# Altium schematic sheet Microcontrolador.SchDoc
size A4; SheetNumber: 3; SheetTotal: 3
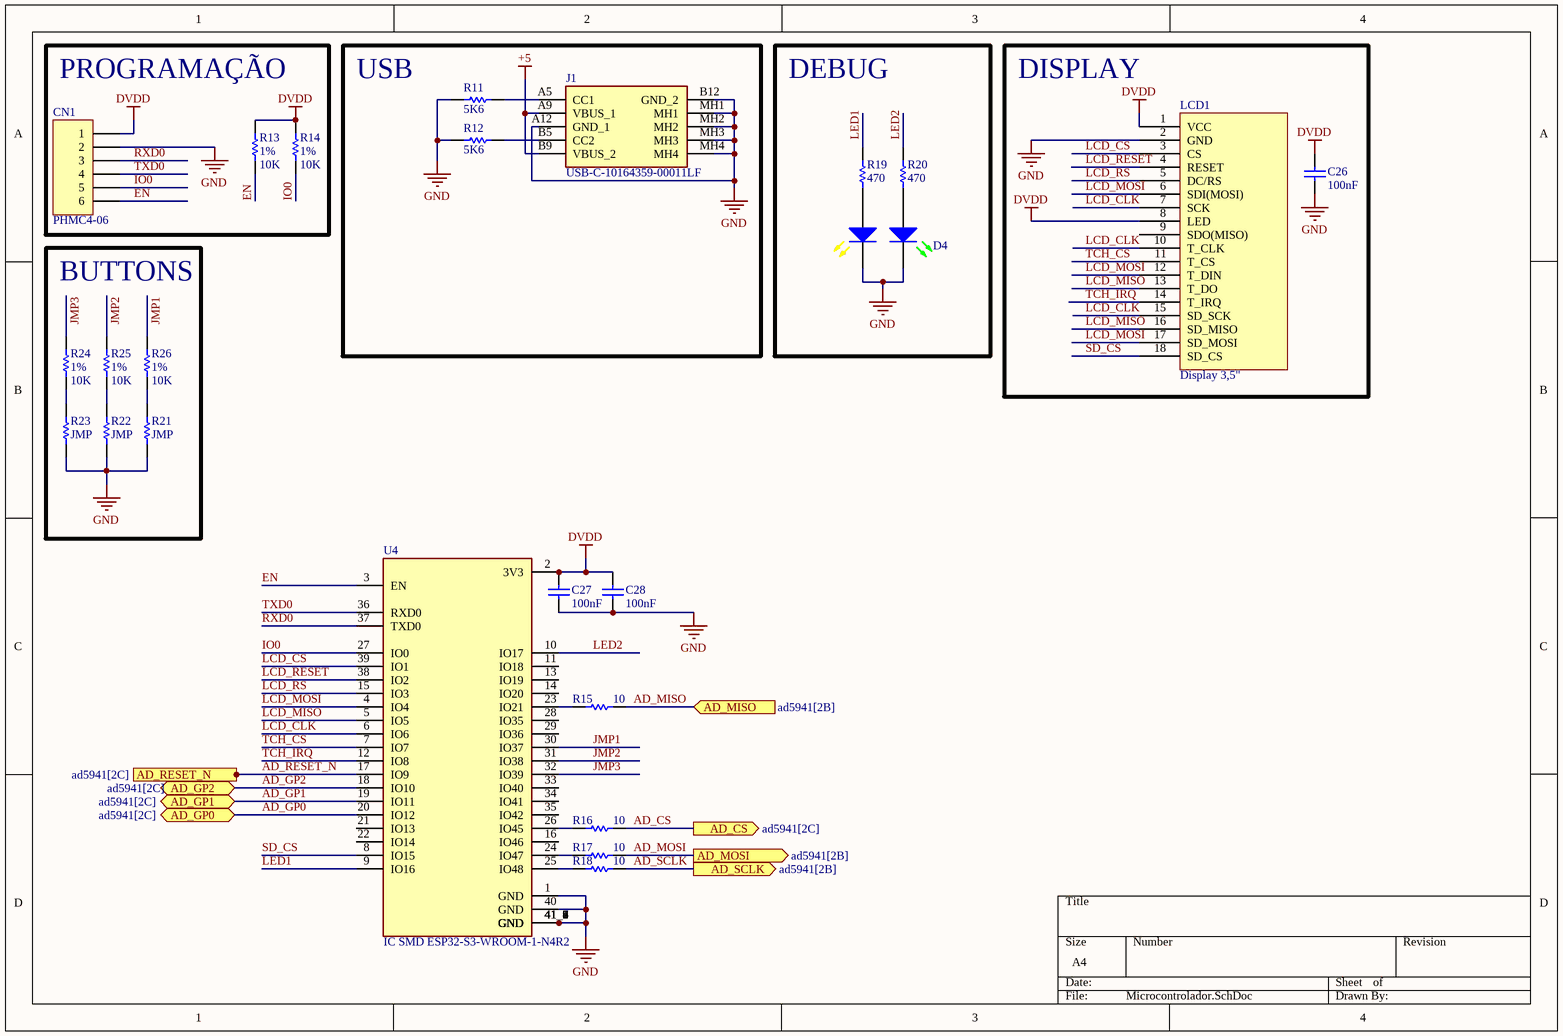
[diagram p0: Microcontrolador.SchDoc]

## Parts
C26  value 100nF  [CAP0805OK]  (hidden comment: CAP SMD CER 100NF 25V 0805)
C27  value 100nF  [CAP0805OK]  (hidden comment: CAP SMD CER 100NF 25V 0805)
C28  value 100nF  [CAP0805OK]  (hidden comment: CAP SMD CER 100NF 25V 0805)
CN1  CN MAC 6 VIAS 180º 2.54MM  [PHMC4-06]  (value not drawn)
D4  LED SMD DUAL  [LTST-C197]  (value not drawn)
J1  USB-C-10164359-00011LF  [USB-C-1016435900011LF]
LCD1  Display 3,5"  [Display_3.5"_SPI_480X320]
R11  value 5K6  [res0805ok]  (hidden comment: RES SMD 5K6 1% 0805)
R12  value 5K6  [res0805ok]  (hidden comment: RES SMD 5K6 1% 0805)
R13  value 10K  Tolerance: 1%  [res0805ok]  (hidden comment: RES SMD 10K 1% 0805)
R14  value 10K  Tolerance: 1%  [res0805ok]  (hidden comment: RES SMD 10K 1% 0805)
R15  value 10  [res0805ok]  (hidden comment: RES SMD 10 1% 0805)
R16  value 10  [res0805ok]  (hidden comment: RES SMD 10 1% 0805)
R17  value 10  [res0805ok]  (hidden comment: RES SMD 10 1% 0805)
R18  value 10  [res0805ok]  (hidden comment: RES SMD 10 1% 0805)
R19  value 470  [res0805ok]  (hidden comment: RES SMD 1K 1% 0805)
R20  value 470  [res0805ok]  (hidden comment: RES SMD 1K 1% 0805)
R21  value JMP  [JMP0805]  (hidden comment: RES SMD 10K 1% 0805)
R22  value JMP  [JMP0805]  (hidden comment: RES SMD 10K 1% 0805)
R23  value JMP  [JMP0805]  (hidden comment: RES SMD 10K 1% 0805)
R24  value 10K  Tolerance: 1%  [res0805ok]  (hidden comment: RES SMD 10K 1% 0805)
R25  value 10K  Tolerance: 1%  [res0805ok]  (hidden comment: RES SMD 10K 1% 0805)
R26  value 10K  Tolerance: 1%  [res0805ok]  (hidden comment: RES SMD 10K 1% 0805)
U4  IC SMD ESP32-S3-WROOM-1-N4R2  [XCVR_ESP32-S3-WROOM-1-N4R2]

## Blocks framed on the sheet
PROGRAMAÇÃO: CN1 R13 R14
USB: J1 R11 R12
DEBUG: D4 R19 R20
DISPLAY: C26 LCD1
BUTTONS: R21-R26

## Ports
AD_CS (out, see ad5941[2C]), AD_GP0 (bidir, see ad5941[2C]), AD_GP1 (bidir, see ad5941[2C]), AD_GP2 (bidir, see ad5941[2C]), AD_MISO (in, see ad5941[2B]), AD_MOSI (out, see ad5941[2B]), AD_RESET_N (out, see ad5941[2C]), AD_SCLK (out, see ad5941[2B])

## Nets
+5: J1.A9(VBUS_1) J1.B9(VBUS_2)
DVDD: C26.2 C27.1 C28.1 CN1.1 LCD1.1(VCC) LCD1.8(LED) R13.2 R14.2 U4.2(3V3)
GND: C26.1 C27.2 C28.2 CN1.2 D4.3(K) D4.4(K) J1.A12(GND_1) J1.B12(GND_2) J1.MH1 J1.MH2 J1.MH3 J1.MH4 LCD1.2(GND) R11.2 R12.2 R21.2 R22.2 R23.2 U4.1(GND) U4.40(GND) U4.41_1(GND) U4.41_2(GND) U4.41_3(GND) U4.41_4(GND) U4.41_5(GND) U4.41_6(GND) U4.41_7(GND) U4.41_8(GND) U4.41_9(GND)
AD_CS: R16.1 ; port AD_CS
AD_GP0: U4.20(IO12) ; port AD_GP0
AD_GP1: U4.19(IO11) ; port AD_GP1
AD_GP2: U4.18(IO10) ; port AD_GP2
AD_MISO: R15.1 ; port AD_MISO
AD_MOSI: R17.1 ; port AD_MOSI
AD_RESET_N: U4.17(IO9) ; port AD_RESET_N
AD_SCLK: R18.1 ; port AD_SCLK
EN: CN1.6 R13.1 U4.3(EN)
IO0: CN1.5 R14.1 U4.27(IO0)
JMP1: R26.2 U4.30(IO37)
JMP2: R25.2 U4.31(IO38)
JMP3: R24.2 U4.32(IO39)
LCD_CLK: LCD1.7(SCK) LCD1.10(T_CLK) LCD1.15(SD_SCK) U4.6(IO6)
LCD_CS: LCD1.3(CS) U4.39(IO1)
LCD_MISO: LCD1.13(T_DO) LCD1.16(SD_MISO) U4.5(IO5)
LCD_MOSI: LCD1.6(SDI(MOSI)) LCD1.12(T_DIN) LCD1.17(SD_MOSI) U4.4(IO4)
LCD_RESET: LCD1.4(RESET) U4.38(IO2)
LCD_RS: LCD1.5(DC/RS) U4.15(IO3)
LED1: R19.2 U4.9(IO16)
LED2: R20.2 U4.10(IO17)
RXD0: CN1.3 U4.37(TXD0)
SD_CS: LCD1.18(SD_CS) U4.8(IO15)
TCH_CS: LCD1.11(T_CS) U4.7(IO7)
TCH_IRQ: LCD1.14(T_IRQ) U4.12(IO8)
TXD0: CN1.4 U4.36(RXD0)
NetD4_1: D4.1(A) R20.1
NetD4_2: D4.2(A) R19.1
NetJ1_A5: J1.A5(CC1) R11.1
NetJ1_B5: J1.B5(CC2) R12.1
NetR15_2: R15.2 U4.23(IO21)
NetR16_2: R16.2 U4.26(IO45)
NetR17_2: R17.2 U4.24(IO47)
NetR18_2: R18.2 U4.25(IO48)
NetR21_1: R21.1 R26.1
NetR22_1: R22.1 R25.1
NetR23_1: R23.1 R24.1

Not connected (* = marked no-connect by the designer): LCD1 9(SDO(MISO)); U4 11(IO18) 13(IO19) 14(IO20) 16(IO46) 21(IO13) 22(IO14) 28(IO35) 29(IO36) 33(IO40) 34(IO41) 35(IO42)

## Library data of the parts
C26-C28 = CAP SMD CER 100NF 25V 0805: COD. CRISTOFOLI: EMP.00094; Tolerance: 10%; List: CAP CER 0.1UF 25V 10% X7R 0805/CGJ4J2X7R1E104K125AA/TDK; Type: CERAMIC; Voltage: 25V
CN1 = CN MAC 6 VIAS 180º 2.54MM: gravação micro; Manufacturer: METALTEX; COD. CRISTOFOLI: EMP.00436; List: Barra de pinos Macho 180° / BPSC-03 / metaltex; Manufacturer Part Number: PHMC4-06
D4 = LED SMD DUAL: COD. CRISTOFOLI: EMP.00010; List: LED - SMD WHITE CLEAR NON-DIFF - SUN LED XZCWD105S / EVERLIGHT 67-21UKC/S3282/TR8-D ( descontinuado) //67-21S/KK2C-H6565M41N42936Z6/2T; Value: BRANCO
J1 = USB-C-10164359-00011LF: Connector; Manufacturer_Name: Amphenol; Datasheet Link: https://cdn.amphenol-cs.com/media/wysiwyg/files/drawing/10164359.pdf; Height: 3.41mm; Manufacturer_Part_Number: 10164359-00011LF; Mouser Part Number: 649-10164359-00011LF; Mouser Price/Stock: https://www.mouser.co.uk/ProductDetail/Amphenol-FCI/10164359-00011LF?qs=MyNHzdoqoQLpQ%2FmSqA1%252BtQ%3D%3D; Arrow Part Number: 10164359-00011LF; Arrow Price/Stock: https://www.arrow.com/en/products/10164359-00011lf/amphenol-fci?region=nac
LCD1 = Display 3,5" SPI: Display TFT SPI 480X320; COD. CRISTOFOLI: EMP.00435; List: Display TFT 3.5" SPI 480X320 MSP3520; Documentações: http://www.lcdwiki.com/3.5inch_SPI_Module_ILI9488_SKU:MSP3520; Datasheet: http://www.lcdwiki.com/res/MSP3520/3.5inch_SPI_Module_MSP3520_User_Manual_EN.pdf
R11-R18 R21-R26 = RES SMD 10K 1% 0805: COD. CRISTOFOLI: EMP.50116; List: RES SMD 10K 1% 0805
  R11 R12 R15-R18 R21-R23: Tolerance: 1%
R19 R20 = RES SMD 1K 1% 0805: COD. CRISTOFOLI: EMP.50098; List: RES SMD 1K 1% 0805; Tolerance: 1%
U4 = IC SMD ESP32-S3-WROOM-1-N4R2: Bluetooth, WiFi 802.11b/g/n, Bluetooth v5.0 Transceiver Module 2.4GHz PCB Trace Surface Mount; MF: Espressif Systems; COD. CRISTOFOLI: EMP.50161; Package: None; Purchase-URL: https://pricing.snapeda.com/search/part/ESP32-S3-WROOM-1-N4R2/?ref=eda; Price: None; Availability: In Stock; Check_prices: https://www.snapeda.com/parts/ESP32-S3-WROOM-1-N4R2/Espressif+Systems/view-part/?ref=eda; MP: ESP32-S3-WROOM-1-N4R2; SnapEDA_Link: https://www.snapeda.com/parts/ESP32-S3-WROOM-1-N4R2/Espressif+Systems/view-part/?ref=snap; Value: *; List: IC SMD ESP32-S3-WROOM-1-N4R2